# Altium schematic sheet [04]-CH340.SchDoc
size A4; Organization: Indruino Co., Ltd; Address1: No. 1, Vo Van Ngan Street; Address2: Thu Duc District, HCMC; SheetNumber: 5; SheetTotal: 9
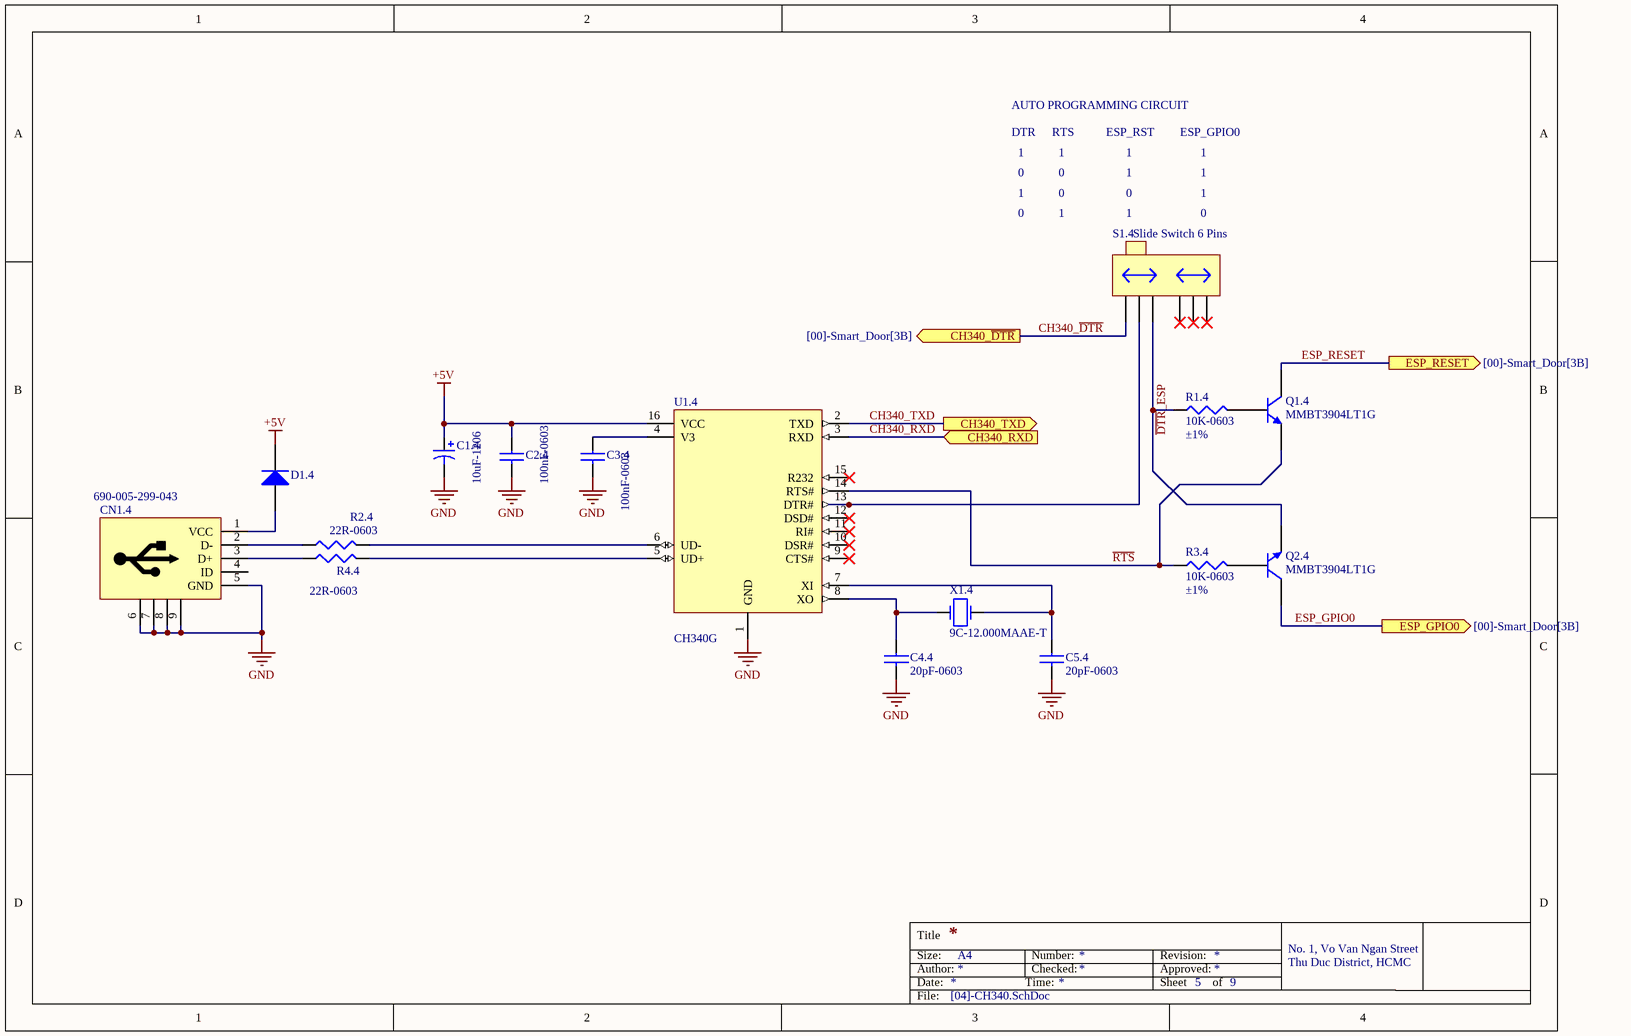
[diagram p0: [04]-CH340.SchDoc]

## Parts
C1.4  10uF-1206  [CAP1206_TANTALUM_YELLOW]
C2.4  100nF-0603  [CAP0603]
C3.4  100nF-0603  [CAP0603]
C4.4  20pF-0603  [CAP0603]
C5.4  20pF-0603  [CAP0603]
CN1.4  690-005-299-043  [USB-B-MINI_690-005-299-043]
D1.4  DIODE_S1A-13-F  [DO-214AC]  (value not drawn)
Q1.4  MMBT3904LT1G  [SOT23-3]
Q2.4  MMBT3904LT1G  [SOT23-3]
R1.4  10K-0603  Tolerance: ±1%  [RES0603]
R2.4  22R-0603  [RES0603]
R3.4  10K-0603  Tolerance: ±1%  [RES0603]
R4.4  22R-0603  [RES0603]
S1.4  Slide Switch 6 Pins  [SW6_MSS-22D18]
U1.4  CH340G  [CH340G]
X1.4  9C-12.000MAAE-T  [XTAL_SMD_HC-49S]

## Ports
CH340_RXD (in, see [00]-Smart_Door[3B]), CH340_TXD (out, see [00]-Smart_Door[3B]), CH340_~{DTR} (out, see [00]-Smart_Door[3B]), ESP_GPIO0 (out, see [00]-Smart_Door[3B]), ESP_RESET (out, see [00]-Smart_Door[3B])

## Nets
+5V: C1.4.1 C2.4.1 D1.4.2(K) U1.4.16(VCC)
GND: C1.4.2 C2.4.2 C3.4.2 C4.4.2 C5.4.2 CN1.4.5(GND) CN1.4.6 CN1.4.7 CN1.4.8 CN1.4.9 U1.4.1(GND)
CH340_~{DTR}: S1.4.1(NC) ; port CH340_~{DTR}
CH340_RXD: U1.4.3(RXD) ; port CH340_RXD
CH340_TXD: U1.4.2(TXD) ; port CH340_TXD
~{DTR}_ESP: Q2.4.2(E) R1.4.1 S1.4.5(NO)
ESP_GPIO0: Q2.4.3(C) ; port ESP_GPIO0
ESP_RESET: Q1.4.3(C) ; port ESP_RESET
~{RTS}: Q1.4.2(E) R3.4.1 U1.4.14(RTS#)
NetC3.4_1: C3.4.1 U1.4.4(V3)
NetC4.4_1: C4.4.1 U1.4.8(XO) X1.4.2(OSC2)
NetC5.4_1: C5.4.1 U1.4.7(XI) X1.4.1(OSC1)
NetCN1.4_1: CN1.4.1(VCC) D1.4.1(A)
NetCN1.4_2: CN1.4.2(D-) R2.4.1
NetCN1.4_3: CN1.4.3(D+) R4.4.1
NetQ1.4_1: Q1.4.1(B) R1.4.2
NetQ2.4_1: Q2.4.1(B) R3.4.2
NetR2.4_2: R2.4.2 U1.4.6(UD-)
NetR4.4_2: R4.4.2 U1.4.5(UD+)
NetS1.4_3: S1.4.3(COM) U1.4.13(DTR#)

Not connected (* = marked no-connect by the designer): CN1.4 4(ID); S1.4 2(NC)* 4(COM)* 6(NO)*; U1.4 9(CTS#)* 10(DSR#)* 11(RI#)* 12(DSD#)* 15(R232)*

## Notes on the sheet
- AUTO PROGRAMMING CIRCUIT
- DTR
- 1
- 0
- RTS
- ESP_RST
- ESP_GPIO0
- Title
- Size:
- Date:
- Author:
- A4
- Time:
- Number:
- Checked:
- Revision:
- Sheet
- Approved:
- of
- File:

## Library data of the parts
C1.4 = T491A106K016AT: CAP TANT 10UF 16V 10% 1206; Manufacturer 1: KEMET; Manufacturer Size Code: A; Category 1: Capacitors; Capacitance: 10µF; Type: Molded; ESR (Equivalent Series Resistance): 7 Ohm; Lifetime @ Temp.: 2000 Hrs @ 85°C; Supplier 1: Digi-Key; Supplier Part Number 1: 399-8269-1-ND; Manufacturer Part Number 1: T491A106K016AT; RoHS 1: RoHS Compliant; Description 1: CAP TANT 10UF 16V 10% 1206; Stock 1: 54083; Pricing 1: 1=0.45, 10=0.312, 100=0.1873, 500=0.14048, 1000=0.11862 (USD); Packaging: Cut Tape (CT); Part Status: Active; Operating Temperature: -55°C ~ 125°C; Mounting Type: Surface Mount; Package / Case: 1206 (3216 Metric); Size / Dimension: 0.126" L x 0.063" W (3.20mm x 1.60mm); Height - Seated (Max): 0.071" (1.80mm); Lead Spacing: -; Features: General Purpose; Failure Rate: -; ComponentLink1URL: http://www.kemet.com/Lists/ProductCatalog/Attachments/254/KEM_T2005_T491.pdf; ComponentLink1Description: http://www.kemet.com/Lists/ProductCatalog/Attachments/254/KEM_T2005_T491.pdf; Value: 10uF; Tolerance: ±10%; Voltage - Rated: 16V
C2.4 C3.4 = CC0603KRX7R0BB104: CAP CER 0.1UF 100V X7R 0603; Manufacturer: Yageo; Tolerance: ±10%; Value: 100nF; Supplier 1: Digi-Key; Manufacturer Part Number: CC0603KRX7R0BB104; RoHS: RoHS Compliant; Category: Capacitors; Stock 1: 784508; Pricing 1: 1=0.23, 10=0.156, 100=0.0791, 500=0.05414, 1000=0.0479 (USD); Packaging: Cut Tape (CT); Part Status: Active; Temperature Coefficient: X7R; Operating Temperature: -55°C ~ 125°C; Features: -; Ratings: -; Applications: General Purpose; Failure Rate: -; Mounting Type: Surface Mount, MLCC; Package / Case: 0603 (1608 Metric); Size / Dimension: 0.063" L x 0.032" W (1.60mm x 0.80mm); Height - Seated (Max): -; Thickness (Max): 0.035" (0.90mm); Lead Spacing: -; Lead Style: -; ComponentLink1URL: http://media.digikey.com/pdf/Data%20Sheets/Yageo%20PDFs/NPO,%20X7R%20Mid-voltage.pdf; ComponentLink1Description: http://media.digikey.com/pdf/Data%20Sheets/Yageo%20PDFs/NPO,%20X7R%20Mid-voltage.pdf; Supplier Part Number 1: 311-1523-1-ND; Voltage - Rated: 100V
C4.4 C5.4 = CC0603JRNPO9BN200: CAP CER 20PF 50V C0G/NPO 0603; Manufacturer 1: Yageo; Category 1: Capacitors; Tolerance: ±5%; Temperature Coefficient: C0G, NP0; Supplier 1: Digi-Key; Supplier Part Number 1: 311-1424-1-ND; Manufacturer Part Number 1: CC0603JRNPO9BN200; RoHS 1: RoHS Compliant; Description 1: CAP CER 20PF 50V C0G/NPO 0603; Stock 1: 67895; Pricing 1: 1=0.1, 10=0.037, 100=0.0164, 500=0.01172, 1000=0.0092 (USD); Packaging: Cut Tape (CT); Part Status: Active; Capacitance: 20pF; Voltage - Rated: 50V; Operating Temperature: -55°C ~ 125°C; Features: -; Ratings: -; Applications: General Purpose; Failure Rate: -; Mounting Type: Surface Mount, MLCC; Package / Case: 0603 (1608 Metric); Size / Dimension: 0.063" L x 0.031" W (1.60mm x 0.80mm); Height - Seated (Max): -; Thickness (Max): 0.035" (0.90mm); Lead Spacing: -; Lead Style: -; ComponentLink1URL: http://www.yageo.com/documents/recent/UPY-GP_NP0_16V-to-50V_16.pdf; ComponentLink1Description: http://www.yageo.com/documents/recent/UPY-GP_NP0_16V-to-50V_16.pdf; Value: 20pF
CN1.4 = USB_690-005-299-043: CONN MINI USB RCPT RA TYPE B SMD; Manufacturer: EDAC Inc.; Connector Type: USB - mini B; Number of Contacts: 5; Gender: Receptacle; Specifications: USB 2.0; Current Rating: 1A; Mating Cycles: 1500; Shielding: Unshielded; Material Flammability Rating: UL94 V-0; Supplier 1: Digi-Key; Manufacturer Part Number: 690-005-299-043; RoHS: RoHS Compliant; Category: Connectors, Interconnects; Stock 1: 72905; Pricing 1: 1=0.54, 10=0.51, 25=0.4592, 50=0.408, 100=0.391, 250=0.357, 500=0.34 (USD); Packaging: Cut Tape (CT); Part Status: Active; Mounting Type: Surface Mount, Right Angle; Mounting Feature: Horizontal; Termination: Solder; Features: Board Guide, Solder Retention; Ingress Protection: -; Operating Temperature: -30°C ~ 80°C; Voltage - Rated: -; Contact Finish: Gold; Shell/Shielding Material: Brass; Insulation Color: Black; ComponentLink1URL: http://files.edac.net/690-005-299-043.pdf; ComponentLink1Description: http://files.edac.net/690-005-299-043.pdf; Supplier Part Number 1: 151-1206-1-ND
D1.4 = DIODE_S1A-13-F: DIODE GEN PURP 50V 1A SMA; Manufacturer: Diodes Incorporated; Diode Type: Standard; Speed: Standard Recovery >500ns, > 200mA (Io); Capacitance @ Vr, F: 10pF @ 4V, 1MHz; Supplier 1: Digi-Key; Manufacturer Part Number: S1A-13-F; RoHS: RoHS Compliant; Category: Discrete Semiconductor Products; Stock 1: 293435; Pricing 1: 1=0.27, 10=0.219, 100=0.1163, 500=0.07652, 1000=0.05203 (USD); Packaging: Digi-Reel®; Part Status: Active; Current - Average Rectified (Io): 1A; Mounting Type: Surface Mount; Package / Case: DO-214AC, SMA; Supplier Device Package: SMA; Operating Temperature - Junction: -65°C ~ 150°C; Base Part Number: S1A; ComponentLink1URL: https://www.diodes.com/assets/Datasheets/ds16003.pdf; ComponentLink1Description: https://www.diodes.com/assets/Datasheets/ds16003.pdf; Supplier Part Number 1: S1A-FDIDKR-ND
Q1.4 Q2.4 = MMBT3904LT1G: TRANS NPN 40V 0.2A SOT23; Manufacturer 1: ON Semiconductor; Category 1: Discrete Semiconductor Products; Current - Collector (Ic) (Max): 200mA; Vce Saturation (Max) @ Ib, Ic: 300mV @ 5mA, 50mA; DC Current Gain (hFE) (Min) @ Ic, Vce: 100 @ 10mA, 1V; Power - Max: 300mW; Frequency - Transition: 300MHz; Supplier 1: Digi-Key; Supplier Part Number 1: MMBT3904LT1GOSCT-ND; Manufacturer Part Number 1: MMBT3904LT1G; RoHS 1: RoHS Compliant; Description 1: TRANS NPN 40V 0.2A SOT23; Stock 1: 366071; Pricing 1: 1=0.11, 10=0.103, 100=0.0562, 500=0.03456, 1000=0.02356 (USD); Packaging: Cut Tape (CT); Part Status: Active; Transistor Type: NPN; Voltage - Collector Emitter Breakdown (Max): 40V; Current - Collector Cutoff (Max): -; Operating Temperature: -55°C ~ 150°C (TJ); Mounting Type: Surface Mount; Package / Case: TO-236-3, SC-59, SOT-23-3; Supplier Device Package: SOT-23-3 (TO-236); ComponentLink1URL: http://www.onsemi.com/pub_link/Collateral/MMBT3904LT1-D.PDF; ComponentLink1Description: http://www.onsemi.com/pub_link/Collateral/MMBT3904LT1-D.PDF
R1.4 R3.4 = RC0603FR-0710KL: RES SMD 10K OHM 1% 1/10W 0603; Manufacturer: Yageo; Power (Watts): 0.1W, 1/10W; Temperature Coefficient: ±100ppm/°C; Supplier 1: Digi-Key; Manufacturer Part Number: RC0603FR-0710KL; RoHS: RoHS Compliant; Category: Resistors; Stock 1: 16545228; Pricing 1: 1=0.1, 10=0.015, 100=0.006, 1000=0.00268, 2500=0.00233 (USD); Packaging: Cut Tape (CT); Part Status: Active; Composition: Thick Film; Features: Moisture Resistant; Operating Temperature: -55°C ~ 155°C; Package / Case: 0603 (1608 Metric); Supplier Device Package: 0603; Size / Dimension: 0.063" L x 0.032" W (1.60mm x 0.80mm); Height - Seated (Max): 0.022" (0.55mm); Failure Rate: -; ComponentLink1URL: http://www.yageo.com/documents/recent/PYu-RC_Group_51_RoHS_L_7.pdf; ComponentLink1Description: http://www.yageo.com/documents/recent/PYu-RC_Group_51_RoHS_L_7.pdf; Supplier Part Number 1: 311-10.0KHRCT-ND; Value: 10K
R2.4 R4.4 = RC0603JR-0722RL: RES SMD 22 OHM 5% 1/10W 0603; Manufacturer 1: Yageo; Category 1: Resistors; Resistance (Ohms): 22; Power (Watts): 0.1W, 1/10W; Temperature Coefficient: ±100ppm/°C; Value: 22R; Supplier 1: Digi-Key; Supplier Part Number 1: 311-22GRCT-ND; Manufacturer Part Number 1: RC0603JR-0722RL; RoHS 1: RoHS Compliant; Description 1: RES SMD 22 OHM 5% 1/10W 0603; Stock 1: 344316; Pricing 1: 1=0.1, 10=0.011, 100=0.0044, 1000=0.00198, 2500=0.00172 (USD); Packaging: Cut Tape (CT); Part Status: Active; Composition: Thick Film; Features: Moisture Resistant; Operating Temperature: -55°C ~ 155°C; Package / Case: 0603 (1608 Metric); Size / Dimension: 0.063" L x 0.031" W (1.60mm x 0.80mm); Height - Seated (Max): 0.022" (0.55mm); Failure Rate: -; ComponentLink1URL: http://www.yageo.com/documents/recent/PYu-RC_Group_51_RoHS_L_7.pdf; ComponentLink1Description: http://www.yageo.com/documents/recent/PYu-RC_Group_51_RoHS_L_7.pdf; Tolerance: ±5%; Supplier Device Package: 0603
S1.4 = Slide Switch 6 Pins: Switch; Published: 24-Mar-1999; LatestRevisionDate: 17-Jul-2002; LatestRevisionNote: Re-released for DXP Platform.; PackageReference: SPST-2; Publisher: Altium Limited
U1.4 = CH340G: USB to serial chip CH340
X1.4 = XTAL_9C-12.000MAAE-T: CRYSTAL 12.0000MHZ 12PF SMD; Manufacturer: TXC CORPORATION; Frequency Stability: ±30ppm; Operating Mode: Fundamental; Supplier 1: Digi-Key; Manufacturer Part Number: 9C-12.000MAAE-T; RoHS: RoHS Compliant; Category: Crystals, Oscillators, Resonators; Stock 1: 0; Pricing 1: 1000=0.208 (USD); Packaging: Tape & Reel (TR); Part Status: Active; Type: MHz Crystal; Frequency Tolerance: ±30ppm; Load Capacitance: 12pF; Operating Temperature: -20°C ~ 70°C; Ratings: -; Mounting Type: Surface Mount; Package / Case: HC-49S; Size / Dimension: 0.449" L x 0.189" W (11.40mm x 4.80mm); Height - Seated (Max): 0.161" (4.10mm); ComponentLink1URL: http://www.txccorp.com/download/products/quartz_crystals/2015TXC_9C_32.pdf; ComponentLink1Description: http://www.txccorp.com/download/products/quartz_crystals/2015TXC_9C_32.pdf; Supplier Part Number 1: 9C-12.000MAAE-T-ND